# Altium schematic sheet ADC.SchDoc
size B; PageSetup: Record=PageOptions|CenterHorizontal=True|CenterVertical=True|PrintScale=1.09|XCorrection=1.00|YCorrection=1.00|PrintKind=1|BorderSize=5000000|LeftOffset=0|BottomOffset=0|Orientation=2|PaperLength=4318|PaperWidth=2794|Scale=100|PaperSource=7|PrintQuality=600|MediaType=1|DitherType=10|PaperKind=11" x 17"|PrintScaleMode=1
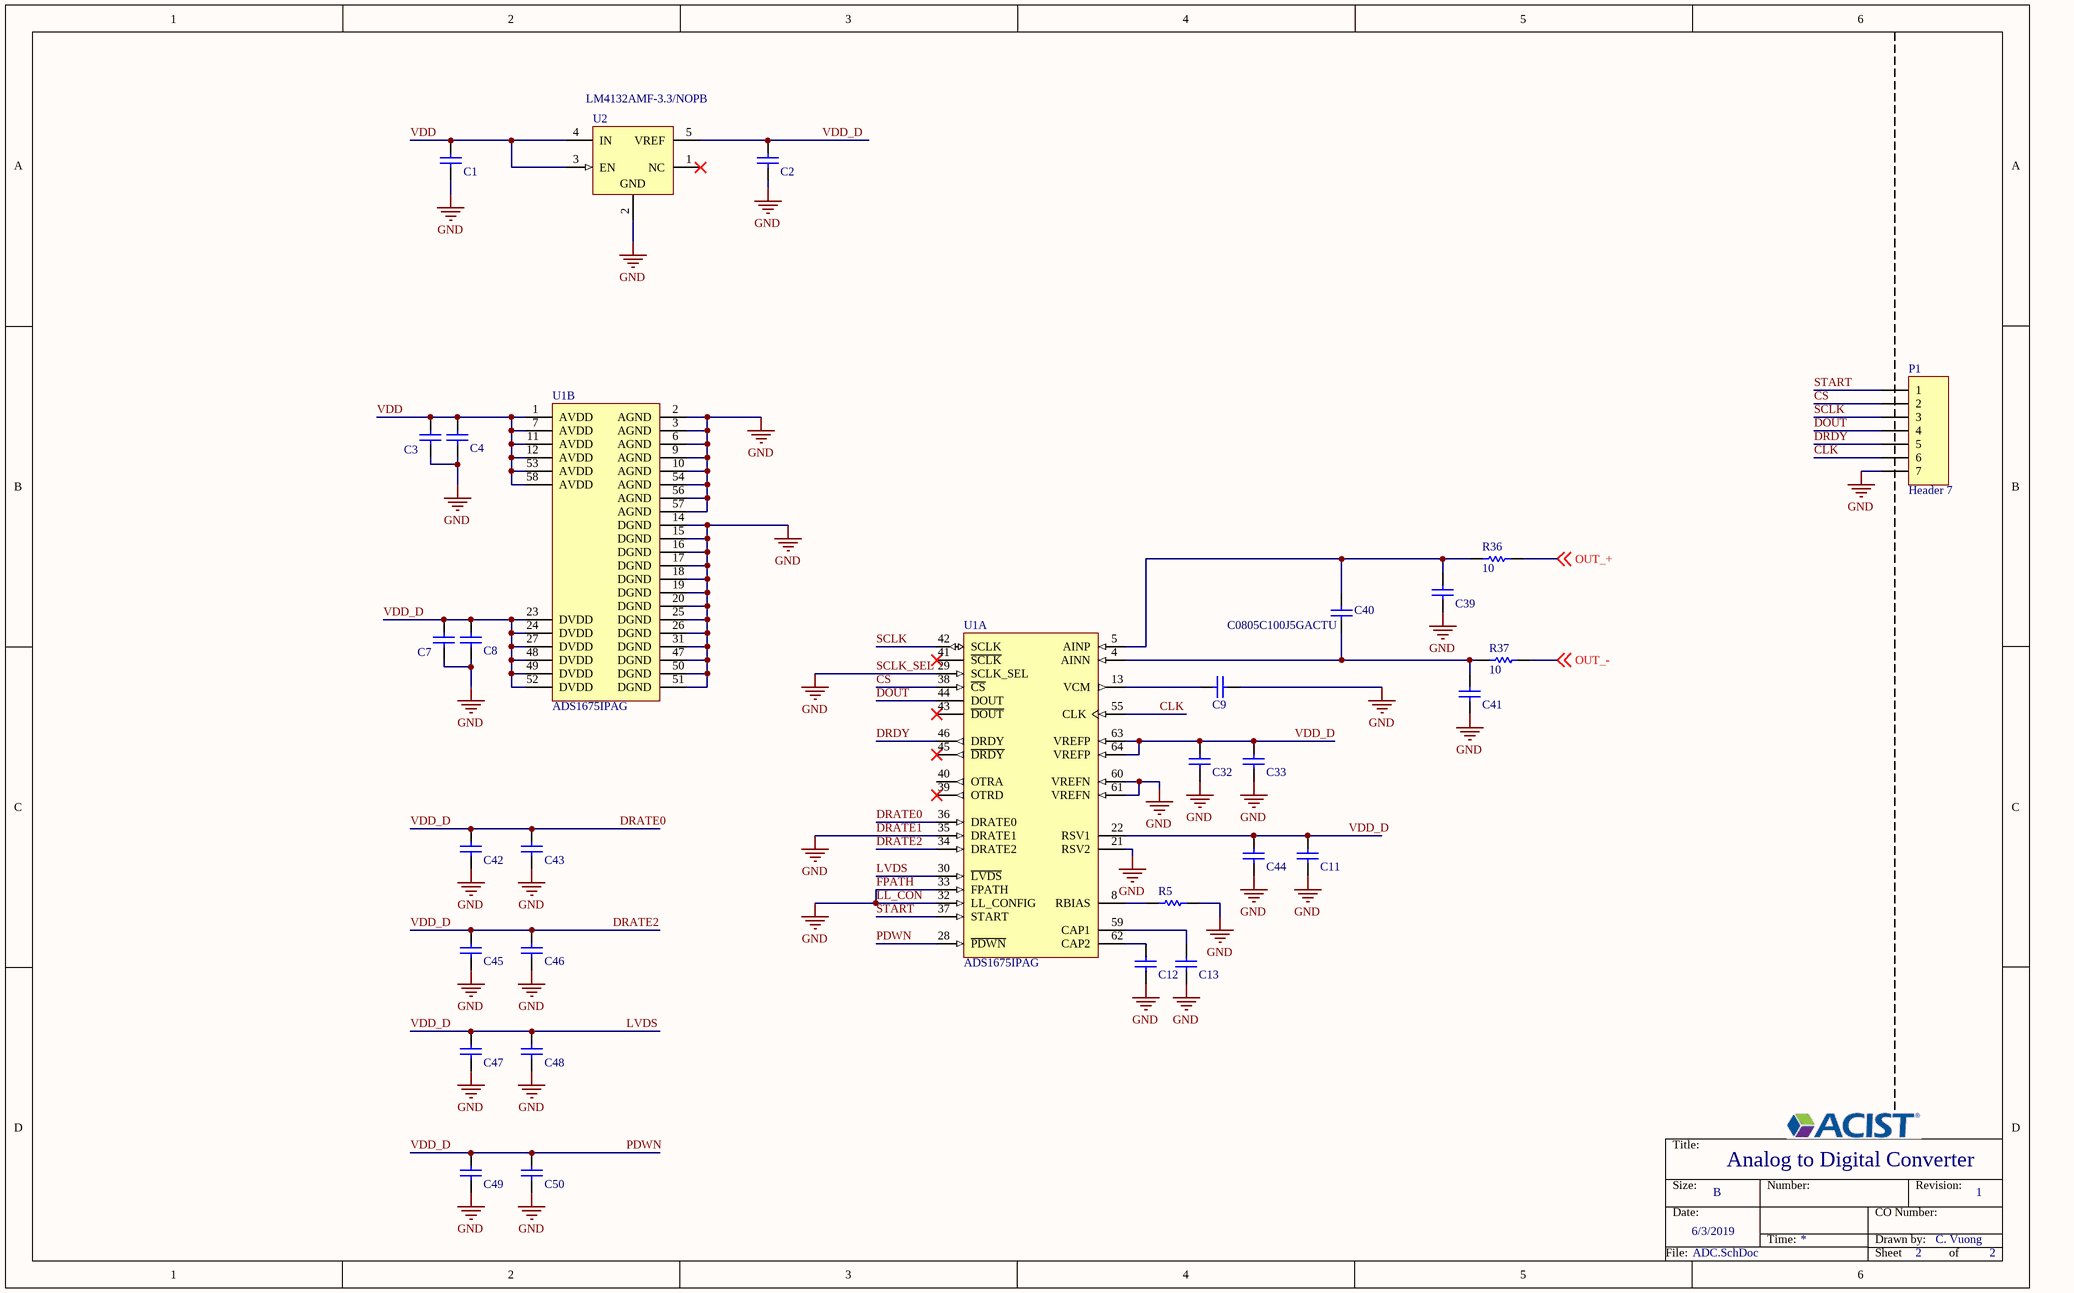
[diagram p0: ADC.SchDoc]

## Parts
C1  C1608X5R1A106K080AC  [CAPC1608X90X20ML10]  (value not drawn)
C2  C1608X5R1A106K080AC  [CAPC1608X90X20ML10]  (value not drawn)
C3  C1608X5R1A106K080AC  [CAPC1608X90X20ML10]  (value not drawn)
C4  C1608X5R1A106K080AC  [CAPC1608X90X20ML10]  (value not drawn)
C7  C1608X5R1A106K080AC  [CAPC1608X90X20ML10]  (value not drawn)
C8  C1608X5R1A106K080AC  [CAPC1608X90X20ML10]  (value not drawn)
C9  C1608X5R1A106K080AC  [CAPC1608X90X20ML10]  (value not drawn)
C11  C1608X5R1A106K080AC  [CAPC1608X90X20ML10]  (value not drawn)
C12  C1608X5R1A106K080AC  [CAPC1608X90X20ML10]  (value not drawn)
C13  C1608X5R1A106K080AC  [CAPC1608X90X20ML10]  (value not drawn)
C32  C1608X5R1A106K080AC  [CAPC1608X90X20ML10]  (value not drawn)
C33  C1608X5R1A106K080AC  [CAPC1608X90X20ML10]  (value not drawn)
C39  C1608X5R1A106K080AC  [CAPC1608X90X20ML10]  (value not drawn)
C40  C0805C100J5GACTU  [CAPC2013X88X50LL20T25]
C41  C1608X5R1A106K080AC  [CAPC1608X90X20ML10]  (value not drawn)
C42  C1608X5R1A106K080AC  [CAPC1608X90X20ML10]  (value not drawn)
C43  C1608X5R1A106K080AC  [CAPC1608X90X20ML10]  (value not drawn)
C44  C1608X5R1A106K080AC  [CAPC1608X90X20ML10]  (value not drawn)
C45  C1608X5R1A106K080AC  [CAPC1608X90X20ML10]  (value not drawn)
C46  C1608X5R1A106K080AC  [CAPC1608X90X20ML10]  (value not drawn)
C47  C1608X5R1A106K080AC  [CAPC1608X90X20ML10]  (value not drawn)
C48  C1608X5R1A106K080AC  [CAPC1608X90X20ML10]  (value not drawn)
C49  C1608X5R1A106K080AC  [CAPC1608X90X20ML10]  (value not drawn)
C50  C1608X5R1A106K080AC  [CAPC1608X90X20ML10]  (value not drawn)
P1  Header 7  [HDR1X7]
R5  RR0816P-241-D  [RESC1608X50X30LL20T20]  (value not drawn)
R36  10  [RESC1608X50X30LL20T20]
R37  10  [RESC1608X50X30LL20T20]
U1  ADS1675IPAG  [TI-PAG64_L]  (parts A,B of 2)
U2  LM4132AMF-3.3/NOPB  [DBV0005A_L]

## Nets
DRATE1: C1.2 C2.2 C3.2 C4.2 C7.2 C8.2 C9.2 C11.2 C12.2 C13.2 C32.2 C33.2 C39.2 C41.2 C42.2 C43.2 C44.2 C45.2 C46.2 C47.2 C48.2 C49.2 C50.2 P1.7 R5.2 U1.2(AGND) U1.3(AGND) U1.6(AGND) U1.9(AGND) U1.10(AGND) U1.14(DGND) U1.15(DGND) U1.16(DGND) U1.17(DGND) U1.18(DGND) U1.19(DGND) U1.20(DGND) U1.21(RSV2) U1.25(DGND) U1.26(DGND) U1.29(SCLK_SEL) U1.31(DGND) U1.32(LL_CONFIG) U1.33(FPATH) U1.35(DRATE1) U1.47(DGND) U1.50(DGND) U1.51(DGND) U1.54(AGND) U1.56(AGND) U1.57(AGND) U1.60(VREFN) U1.61(VREFN) U2.2(GND)  [also labelled FPATH, GND, LL_CON, SCLK_SEL]
CLK: P1.6 U1.55(CLK)
CS: P1.2 U1.38(~{CS})
DOUT: P1.4 U1.44(DOUT)
DRATE0: C2.1 C7.1 C8.1 C11.1 C32.1 C33.1 C42.1 C43.1 C44.1 C45.1 C46.1 C47.1 C48.1 C49.1 C50.1 U1.22(RSV1) U1.23(DVDD) U1.24(DVDD) U1.27(DVDD) U1.28(~{PDWN}) U1.30(~{LVDS}) U1.34(DRATE2) U1.36(DRATE0) U1.48(DVDD) U1.49(DVDD) U1.52(DVDD) U1.63(VREFP) U1.64(VREFP) U2.5(VREF)  [also labelled DRATE2, LVDS, PDWN, VDD_D]
DRDY: P1.5 U1.46(DRDY)
OUT_+: R36.1 ; off-sheet OUT_+
OUT_-: R37.1 ; off-sheet OUT_-
SCLK: P1.3 U1.42(SCLK)
START: P1.1 U1.37(START)
VDD: C1.1 C3.1 C4.1 U1.1(AVDD) U1.7(AVDD) U1.11(AVDD) U1.12(AVDD) U1.53(AVDD) U1.58(AVDD) U2.3(EN) U2.4(IN)
NetC9_1: C9.1 U1.13(VCM)
NetC12_1: C12.1 U1.62(CAP2)
NetC13_1: C13.1 U1.59(CAP1)
NetC39_1: C39.1 C40.2 R36.2 U1.5(AINP)
NetC40_1: C40.1 C41.1 R37.2 U1.4(AINN)
NetR5_1: R5.1 U1.8(RBIAS)

Not connected (* = marked no-connect by the designer): U1 39(OTRD)* 40(OTRA) 41(~{SCLK})* 43(~{DOUT})* 45(~{DRDY})*; U2 1(NC)*

## Notes on the sheet
- Analog to Digital Converter
- 6/3/2019
- C. Vuong
- 1
- 2
- Title:
- Size:
- Date:
- B
- Number:
- Time:
- CO Number:
- Drawn by:
- Revision:
- File:
- Sheet
- of

## Library data of the parts
C1-C4 C7-C9 C11-C13 C32 C33 C39 C41-C50 = CMP-2000-04979-1: Chip Capacitor, 10 uF, +/- 10%, 10 V, -55 to 85 degC, 0603 (1608 Metric), RoHS, Tape and Reel; PCN Part Number: MLCCPartNumberChange30/Nov/2012; Manufacturer: TDK; Temperature Coefficient: X5R; Product Training Modules: CSeriesGeneralApplicationsSEAT,CCV,andTVCLDesignToolsGuidetoReplacinganElectrolyticCapacitorwithanMLCC; Online Catalog: CSeries,GeneralPurpose; Voltage - Rated: 10V; Other Names: 445-7486-1; Capacitance: 10µF; Design Resources: 20WNon-IsolatedBuckLEDDriverUsingPLLNK460KG; Kits: 445-9003-KIT-ND-KITCAPCERHICAPMLCCSMD; Height - Seated (Max): -; Family: CeramicCapacitors; Package Description: 2-Pin Surface Mount Device, Body 1.6 x 0.8 mm; Category: Capacitors; Datasheet Version: Mar-15; RoHS Information: RoHSCertificate-MLCC; Thickness (Max): 0.035"(0.90mm); Operating Temperature: -55degC~85degC; Package Reference: 603; Series: C; Applications: GeneralPurpose; Datasheet URL: http://download.siliconexpert.com/pdfs/2015/4/21/15/54/45/779/tdk_/manual/37024850441143360mlcc_commercial_general_en.pdf; Features: -; Lead Style: -; Lead Spacing: -; Ratings: -; Size / Dimension: 0.063"Lx0.031"W(1.60mmx0.80mm); Tolerance: ±10%; Mounting Type: SurfaceMount,MLCC; Standard Package: 1; Package / Case: 0603(1608Metric); Manufacturer URL: http://www.tdk.com/; Packaging: CutTape(CT)
C40 = CMP-2007-00219-1: Manufacturer: Kemet; Part Number: C0805C100J5GACTU
P1 = Header 7: Header, 7-Pin; LatestRevisionDate: 17-Jul-2002; LatestRevisionNote: Re-released for DXP Platform.; Publisher: Altium Limited
R5 = CMP-2000-02559-1: Manufacturer: Susumu; Part Number: RR0816P-241-D
R36 R37 = CMP-2000-02559-1: Part Number: RR0816P-241-D; Manufacturer: Susumu
U1 = CMP-0003-00593-1: 4 MSPS, 24-Bit ADC, -40 to 85 degC, 64-pin QFP (PAG64), Green (RoHS & no Sb/Br); Manufacturer: Texas Instruments; Analog Voltage AV/DD(Min)(V): 4.75; Analog Voltage AV/DD(Max)(V): 5.25; SFDR(dB): 120; Resolution(Bits): 24; # Input Channels: 1; SubFamily: Precision ADC (<=10MSPS); Architecture: Delta-Sigma; SNR(dB): 92; Digital Supply(Min)(V): 2.85; Sample Rate (max)(SPS): 4M; Digital Supply(Max)(V): 3.15; Interface: Parallel LVDS, Serial SPI; Eco-Plan: Green (RoHS & no Sb/Br); ComponentLink3URL: http://www.ti.com/lit/ml/mtqf006a/mtqf006a.pdf; PackageDescription: 64-Pin Plastic Flat Pack, Body 10 x 10 mm, Pitch 0.50 mm; PackageVersion: 4040282/C, 11/1996; Mounting Technology: Surface Mount; ComponentLink1URL: http://www.ti.com/; ComponentLink2URL: http://www.ti.com/general/docs/lit/getliterature.tsp?genericPartNumber=ADS1675&fileType=pdf; PartNumber: ADS1675IPAG; ComponentLink2Description: Datasheet; ComponentLink3Description: Package Specification; PackageReference: PAG64; ComponentLink1Description: Manufacturer URL; Code_JEDEC: MS-026; DatasheetVersion: SBAS416D
U2 = CMP-0074-00542-5: Precision Low Dropout Voltage Reference, 5-pin SOT-23, Pb-Free; Manufacturer: Texas Instruments; PackageTopMarking: R4EA*XTT; PowerWise: Y; CompType: Voltage Reference IC; ComponentLink1URL: http://www.ti.com/general/docs/lit/getliterature.tsp?genericPartNumber=LM4132&fileType=pdf; PartNumber: LM4132AMF-3.3/NOPB; DatasheetVersion: Aug-2006; RevisionNote: PowerWise parameter updated.; PackageVersion: revD, Aug-2008; ComponentLink1Description: Datasheet; PinCount: 5; PackageReference: DBV0005A; RoHS: Y; PackageDescription: Molded SOT-23, .115 x .063 x .040 in Body, 5 Lead, .0375 in Pitch; High-Reliability: Y